# Altium schematic sheet A3988 Breakout.SchDoc: A3988 Testing harness
size A; Author: Anthony Clay; CompanyName: ZarthCode LLC
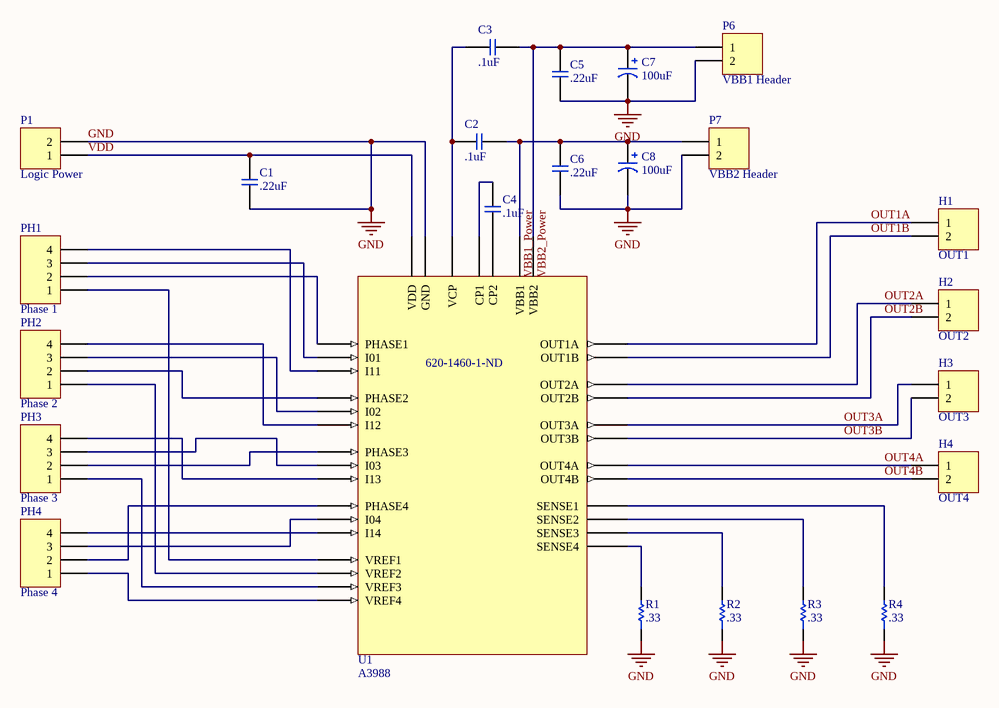
[diagram p0: A3988 Breakout.SchDoc]

## Parts
C1  .22uF  [C0805N]
C2  .1uF  [C0805N]
C3  .1uF  [C0805N]
C4  .1uF  [C0805N]
C5  .22uF  [C0805N]
C6  .22uF  [C0805N]
C7  100uF  [F]
C8  100uF  [F]
H1  OUT1  [HDR1X2]
H2  OUT2  [HDR1X2]
H3  OUT3  [HDR1X2]
H4  OUT4  [HDR1X2]
P1  Logic Power  [HDR1X2]
P6  VBB1 Header  [HDR1X2]
P7  VBB2 Header  [HDR1X2]
PH1  Phase 1  [HDR1X4]
PH2  Phase 2  [HDR1X4]
PH3  Phase 3  [HDR1X4]
PH4  Phase 4  [HDR1X4]
R1  .33  [R2512N]
R2  .33  [R2512N]
R3  .33  [R2512N]
R4  .33  [R2512N]
U1  A3988  Supplier Part Number 1: 620-1460-1-ND  [JP]

## Nets
GND: C1.1 C5.1 C6.1 C7.2 C8.2 P1.2 P6.2 P7.2 R1.2 R2.2 R3.2 R4.2 U1.GND
OUT1A: H1.1 U1.OUT1A
OUT1B: H1.2 U1.OUT1B
OUT2A: H2.1 U1.OUT2A
OUT2B: H2.2 U1.OUT2B
OUT3A: H3.1 U1.OUT3A
OUT3B: H3.2 U1.OUT3B
OUT4A: H4.1 U1.OUT4A
OUT4B: H4.2 U1.OUT4B
VBB1_Power: C2.1 C6.2 C8.1 P7.1 U1.VBB1
VBB2_Power: C3.1 C5.2 C7.1 P6.1 U1.VBB2
VDD: C1.2 P1.1 U1.VDD
NetC2_2: C2.2 C3.2 U1.VCP
NetC4_1: C4.1 U1.CP2
NetC4_2: C4.2 U1.CP1
NetPH1_1: PH1.1 U1.VREF1
NetPH1_2: PH1.2 U1.PHASE1
NetPH1_3: PH1.3 U1.I01
NetPH1_4: PH1.4 U1.I11
NetPH2_1: PH2.1 U1.VREF2
NetPH2_2: PH2.2 U1.PHASE2
NetPH2_3: PH2.3 U1.I02
NetPH2_4: PH2.4 U1.I12
NetPH3_1: PH3.1 U1.VREF3
NetPH3_2: PH3.2 U1.PHASE3
NetPH3_3: PH3.3 U1.I03
NetPH3_4: PH3.4 U1.I13
NetPH4_1: PH4.1 U1.VREF4
NetPH4_2: PH4.2 U1.PHASE4
NetPH4_3: PH4.3 U1.I04
NetPH4_4: PH4.4 U1.I14
NetR1_1: R1.1 U1.SENSE4
NetR2_1: R2.1 U1.SENSE3
NetR3_1: R3.1 U1.SENSE2
NetR4_1: R4.1 U1.SENSE1

## Library data of the parts
C1-C6 = Capacitor
  C1 C5 C6: Value: .22uF
  C2-C4: Value: .1uF
C7 C8 = Electrolytic Capacitor: Value: 100uF
H1-H4 P1 P6 P7 = Header 2: Header, 2-Pin; LatestRevisionDate: 17-Jul-2002; LatestRevisionNote: Re-released for DXP Platform.; Publisher: Altium Limited
PH1-PH4 = Header 4: Header, 4-Pin; LatestRevisionDate: 17-Jul-2002; LatestRevisionNote: Re-released for DXP Platform.; Publisher: Altium Limited
R1-R4 = Resistor: Passive Resistor; Value: .33
  R1: Supplier 1: Digi-Key; Supplier Part Number 1: A106128DKR-ND
U1 = A3988: Quad DMOS Full Bridge PWM Motor Driver; pin to pad: CP1>43 CP2>44 GND>20 I01>45 I02>46 I03>47 I04>48 I11>39 I12>38 I13>37 I14>24 OUT1A>3 OUT1B>5 OUT2A>10 OUT2B>8 OUT3A>34 OUT3B>32 OUT4A>27 OUT4B>29 PHASE1>22 PHASE2>21 PHASE3>14 PHASE4>13 SENSE1>4 SENSE2>9 SENSE3>33 SENSE4>28 VBB1>6 VBB2>31 VCP>42 VDD>15 VREF1>16 VREF2>17 VREF3>18 VREF4>19; Supplier 1: Digi-Key